# Altium schematic sheet SensWear_Debug_Main.SchDoc
size A4; DocumentNumber: 1; SheetNumber: 1; SheetTotal: 5; Size: A4
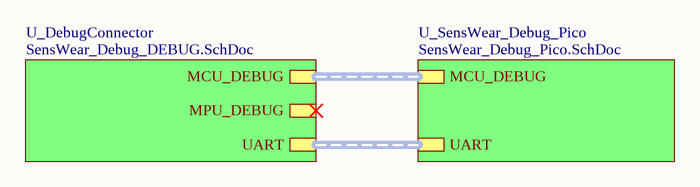
[diagram p0: SensWear_Debug_Main.SchDoc]

## Sub-sheets
U_DebugConnector = SensWear_Debug_DEBUG.SchDoc: MCU_DEBUG (harness MCU_DEBUG), MPU_DEBUG (harness MPU_DEBUG), UART (harness UART)
U_SensWear_Debug_Pico = SensWear_Debug_Pico.SchDoc: MCU_DEBUG (harness SWD), UART (harness UART)

## Buses and harness runs
harness sheet U_DebugConnector/MCU_DEBUG = sheet U_SensWear_Debug_Pico/MCU_DEBUG
harness sheet U_DebugConnector/UART = sheet U_SensWear_Debug_Pico/UART

## Notes on the sheet
- Designer/Engineer
- Drawn By
- Document Name
- Board Title
- Sheet
- of
- Size
- A4
- Approved By
- Rev.
- Date